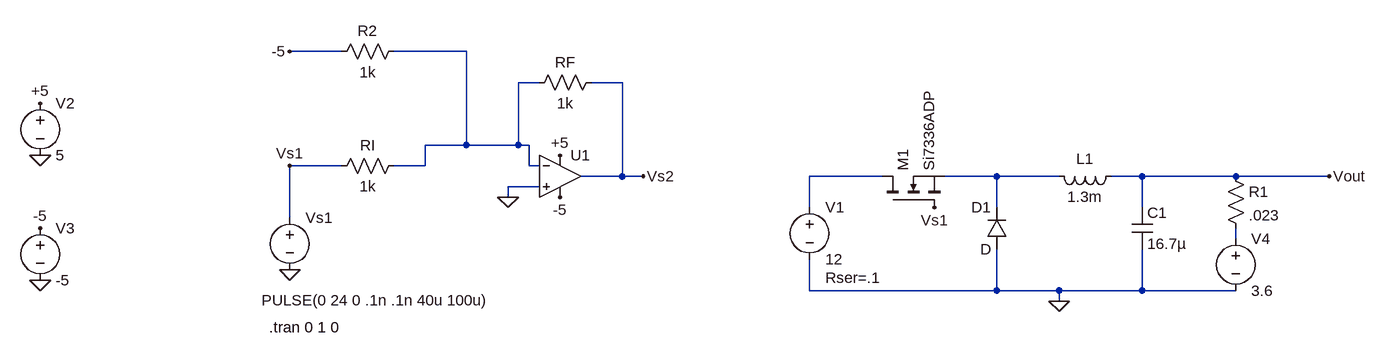
[diagram p0: schematic BuckConverter_RM.asc]
BuckConverter_RM.asc, the LTspice schematic file:
Version 4
SHEET 1 888 680
WIRE -704 -96 -784 -96
WIRE -512 -96 -624 -96
WIRE -400 -48 -432 -48
WIRE -272 -48 -320 -48
WIRE -512 48 -512 -96
WIRE -512 48 -576 48
WIRE -432 48 -432 -48
WIRE -432 48 -512 48
WIRE -416 48 -432 48
WIRE -704 80 -784 80
WIRE -576 80 -576 48
WIRE -576 80 -624 80
WIRE -416 80 -416 48
WIRE -400 80 -416 80
WIRE -272 96 -272 -48
WIRE -272 96 -336 96
WIRE -240 96 -272 96
WIRE 128 96 16 96
WIRE 304 96 224 96
WIRE 400 96 304 96
WIRE 528 96 480 96
WIRE 672 96 528 96
WIRE 816 96 672 96
WIRE -400 112 -448 112
WIRE -448 128 -448 112
WIRE 16 144 16 96
WIRE 304 144 304 96
WIRE 528 144 528 96
WIRE -784 160 -784 80
WIRE 672 192 672 176
WIRE 16 272 16 224
WIRE 304 272 304 208
WIRE 304 272 16 272
WIRE 400 272 304 272
WIRE 528 272 528 208
WIRE 528 272 400 272
WIRE 672 272 528 272
WIRE 400 288 400 272
FLAG 400 288 0
FLAG -784 240 0
FLAG 208 144 Vs1
FLAG -368 64 +5
FLAG -448 128 0
FLAG -240 96 Vs2
FLAG -1168 -16 +5
FLAG -1168 176 -5
FLAG -1168 64 0
FLAG -1168 256 0
FLAG -784 -96 -5
FLAG -368 128 -5
FLAG 816 96 Vout
FLAG -784 80 Vs1
SYMBOL voltage 16 128 R0
WINDOW 123 0 0 Left 0
WINDOW 39 24 124 Left 2
SYMATTR SpiceLine Rser=.1
SYMATTR InstName V1
SYMATTR Value 12
SYMBOL nmos 128 144 R270
SYMATTR InstName M1
SYMATTR Value Si7336ADP
SYMBOL ind 496 80 R90
WINDOW 0 5 56 VBottom 2
WINDOW 3 32 56 VTop 2
SYMATTR InstName L1
SYMATTR Value 1.3m
SYMBOL cap 512 144 R0
SYMATTR InstName C1
SYMATTR Value 16.7µ
SYMBOL voltage -784 144 R0
WINDOW 3 -43 143 Left 2
WINDOW 123 0 0 Left 0
WINDOW 39 0 0 Left 0
SYMATTR Value PULSE(0 24 0 .1n .1n 40u 100u)
SYMATTR InstName Vs1
SYMBOL OpAmps\\UniversalOpamp2 -368 96 R0
SYMATTR InstName U1
SYMBOL res -608 64 R90
WINDOW 0 0 56 VBottom 2
WINDOW 3 32 56 VTop 2
SYMATTR InstName RI
SYMATTR Value 1k
SYMBOL res -304 -64 R90
WINDOW 0 0 56 VBottom 2
WINDOW 3 32 56 VTop 2
SYMATTR InstName RF
SYMATTR Value 1k
SYMBOL res -608 -112 R90
WINDOW 0 0 56 VBottom 2
WINDOW 3 32 56 VTop 2
SYMATTR InstName R2
SYMATTR Value 1k
SYMBOL voltage -1168 -32 R0
WINDOW 123 0 0 Left 0
WINDOW 39 0 0 Left 0
SYMATTR InstName V2
SYMATTR Value 5
SYMBOL voltage -1168 160 R0
WINDOW 123 0 0 Left 0
WINDOW 39 0 0 Left 0
SYMATTR InstName V3
SYMATTR Value -5
SYMBOL diode 320 208 R180
WINDOW 0 24 64 Left 2
WINDOW 3 24 0 Left 2
SYMATTR InstName D1
SYMBOL voltage 672 176 R0
WINDOW 123 0 0 Left 0
WINDOW 39 0 0 Left 0
SYMATTR InstName V4
SYMATTR Value 3.6
SYMBOL res 656 80 R0
SYMATTR InstName R1
SYMATTR Value .023
TEXT -816 328 Left 2 !.tran 0 1 0

The netlist it stands for:
* BuckConverter_RM.asc
V1 N002 0 12 Rser=.1
M1 N002 Vs1 N003 N003 Si7336ADP
L1 Vout N003 1.3m
C1 Vout 0 16.7µ
Vs1 Vs1 0 PULSE(0 24 0 .1n .1n 40u 100u)
XU1 0 N001 +5 -5 Vs2 level.2 Avol=1Meg GBW=10Meg Slew=10Meg ilimit=25m rail=0 Vos=0 phimargin=45 en=0 enk=0 in=0 ink=0 Rin=500Meg  ; pins IN+ IN- V+ V- OUT
RI N001 Vs1 1k
RF Vs2 N001 1k
R2 N001 -5 1k
V2 +5 0 5
V3 -5 0 -5
D1 0 N003 D
V4 N004 0 3.6
R1 Vout N004 .023
.model D D
.lib standard.dio
.model NMOS NMOS
.model PMOS PMOS
.lib standard.mos
.tran 0 1 0
.lib UniversalOpamps2.sub
.backanno
.end